# EAGLE schematic button (EAGLE 6.5.0)
AUTHOR: Neal Jackson; REV: A; TITLE: BMO Button Plate
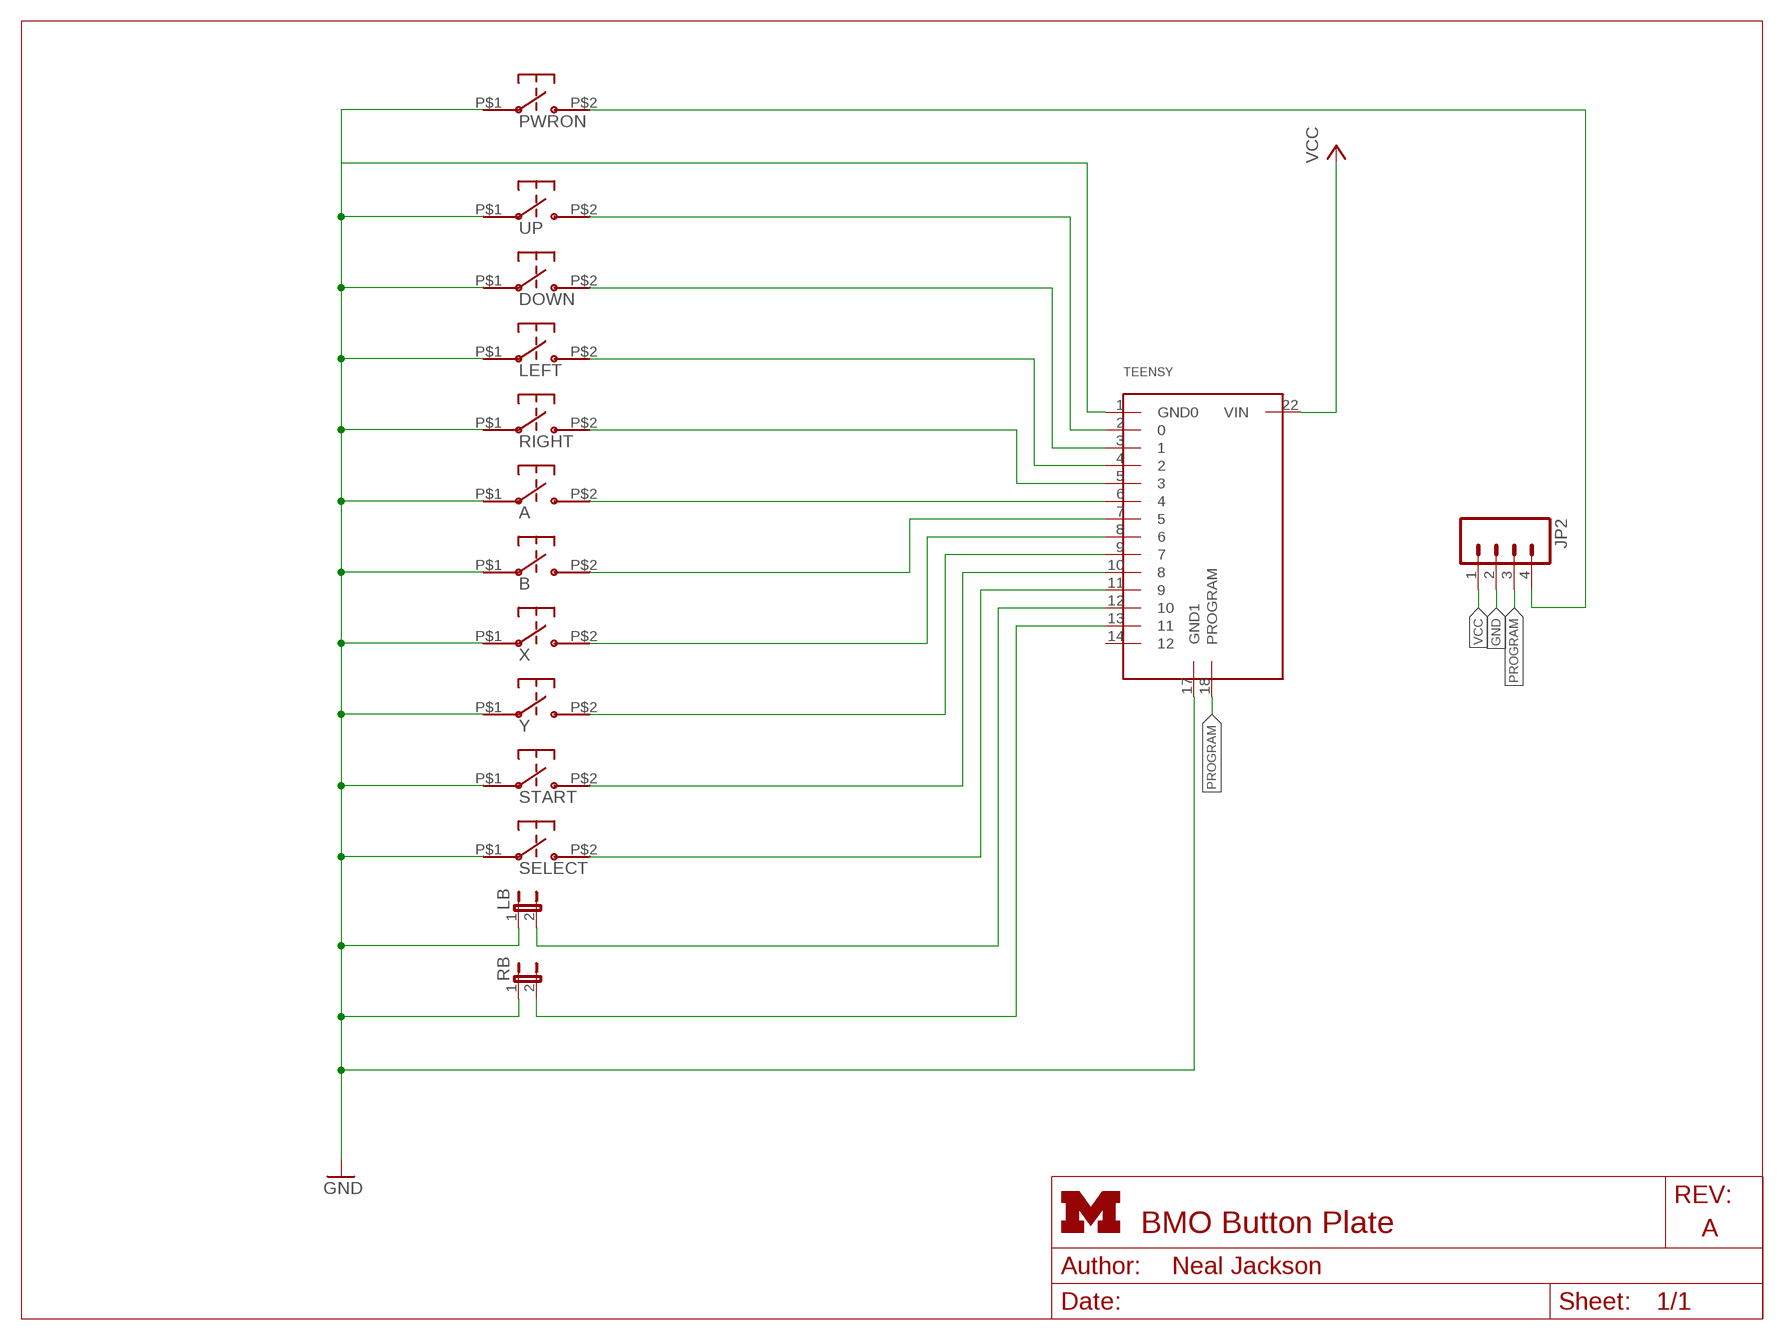
[diagram p0: schematic, sheet 1]
FRAME1 (LETTER_L): HEIGHT: 8.5in; WIDTH: 11in

## Parts
A  SKPDAMD010  [SKPDAMD010]
B  SKPDAMD010  [SKPDAMD010]
DOWN  SKPDAMD010  [SKPDAMD010]
JP2  M04PTH  [1X04]
LB  JUMPER-2PTH  [1X02]
LEFT  SKPDAMD010  [SKPDAMD010]
PWRON  SKPDAMD010  [SKPDAMD010]
RB  JUMPER-2PTH  [1X02]
RIGHT  SKPDAMD010  [SKPDAMD010]
SELECT  EVQ11D09K  [EVQ11D09K]
START  EVQ11D09K  [EVQ11D09K]
TEENSY  TEENSY_LC  [TEENSY_LC]
UP  SKPDAMD010  [SKPDAMD010]
X  SKPDAMD010  [SKPDAMD010]
Y  SKPDAMD010  [SKPDAMD010]

## Nets
GND: A.P$1 B.P$1 DOWN.P$1 JP2.2 LB.1 LEFT.P$1 PWRON.P$1 RB.1 RIGHT.P$1 SELECT.P$1 START.P$1 TEENSY.1(GND0) TEENSY.17(GND1) UP.P$1 X.P$1 Y.P$1
N$1: A.P$2 TEENSY.6
N$2: JP2.4 PWRON.P$2
N$3: TEENSY.2 UP.P$2
N$4: DOWN.P$2 TEENSY.3
N$5: LEFT.P$2 TEENSY.4
N$6: RIGHT.P$2 TEENSY.5
N$8: B.P$2 TEENSY.7
N$9: TEENSY.8 X.P$2
N$10: TEENSY.9 Y.P$2
N$11: START.P$2 TEENSY.10
N$12: SELECT.P$2 TEENSY.11
N$13: LB.2 TEENSY.12
N$14: RB.2 TEENSY.13
PROGRAM: JP2.3 TEENSY.18(PROGRAM)
VCC: JP2.1 TEENSY.22(VIN)
Unconnected: TEENSY.14

## Library data of the parts
A B DOWN LEFT PWRON RIGHT UP X Y = switches:SKPDAMD010; MOUSER: 688-SKPDAM
JP2 = SparkFun-Connectors:M04: Header 4 Standard 4-pin 0.1" header. Use with straight break away headers (SKU : PRT-00116), right angle break away headers (PRT-00553), swiss pins (PRT-00743), machine pins (PRT-00117), and female headers (PRT-00115). Molex polarized connector foot print use with SKU : PRT-08231 with associated crimp pins and housings. 1MM SMD Version SKU: PRT-10208
LB RB = umich:JUMPER-2: Jumper Basic 0.1" spaced jumper. Use with breakaway headers.
SELECT START = BMO:EVQ11D09K
TEENSY = BMO:TEENSY_LC